# EAGLE design m328plain (EAGLE 7.1.0)
CNAME: ATmega328P PTH + SMD Dev Board; CREVISION: 0.1; DESIGNER: RNDC
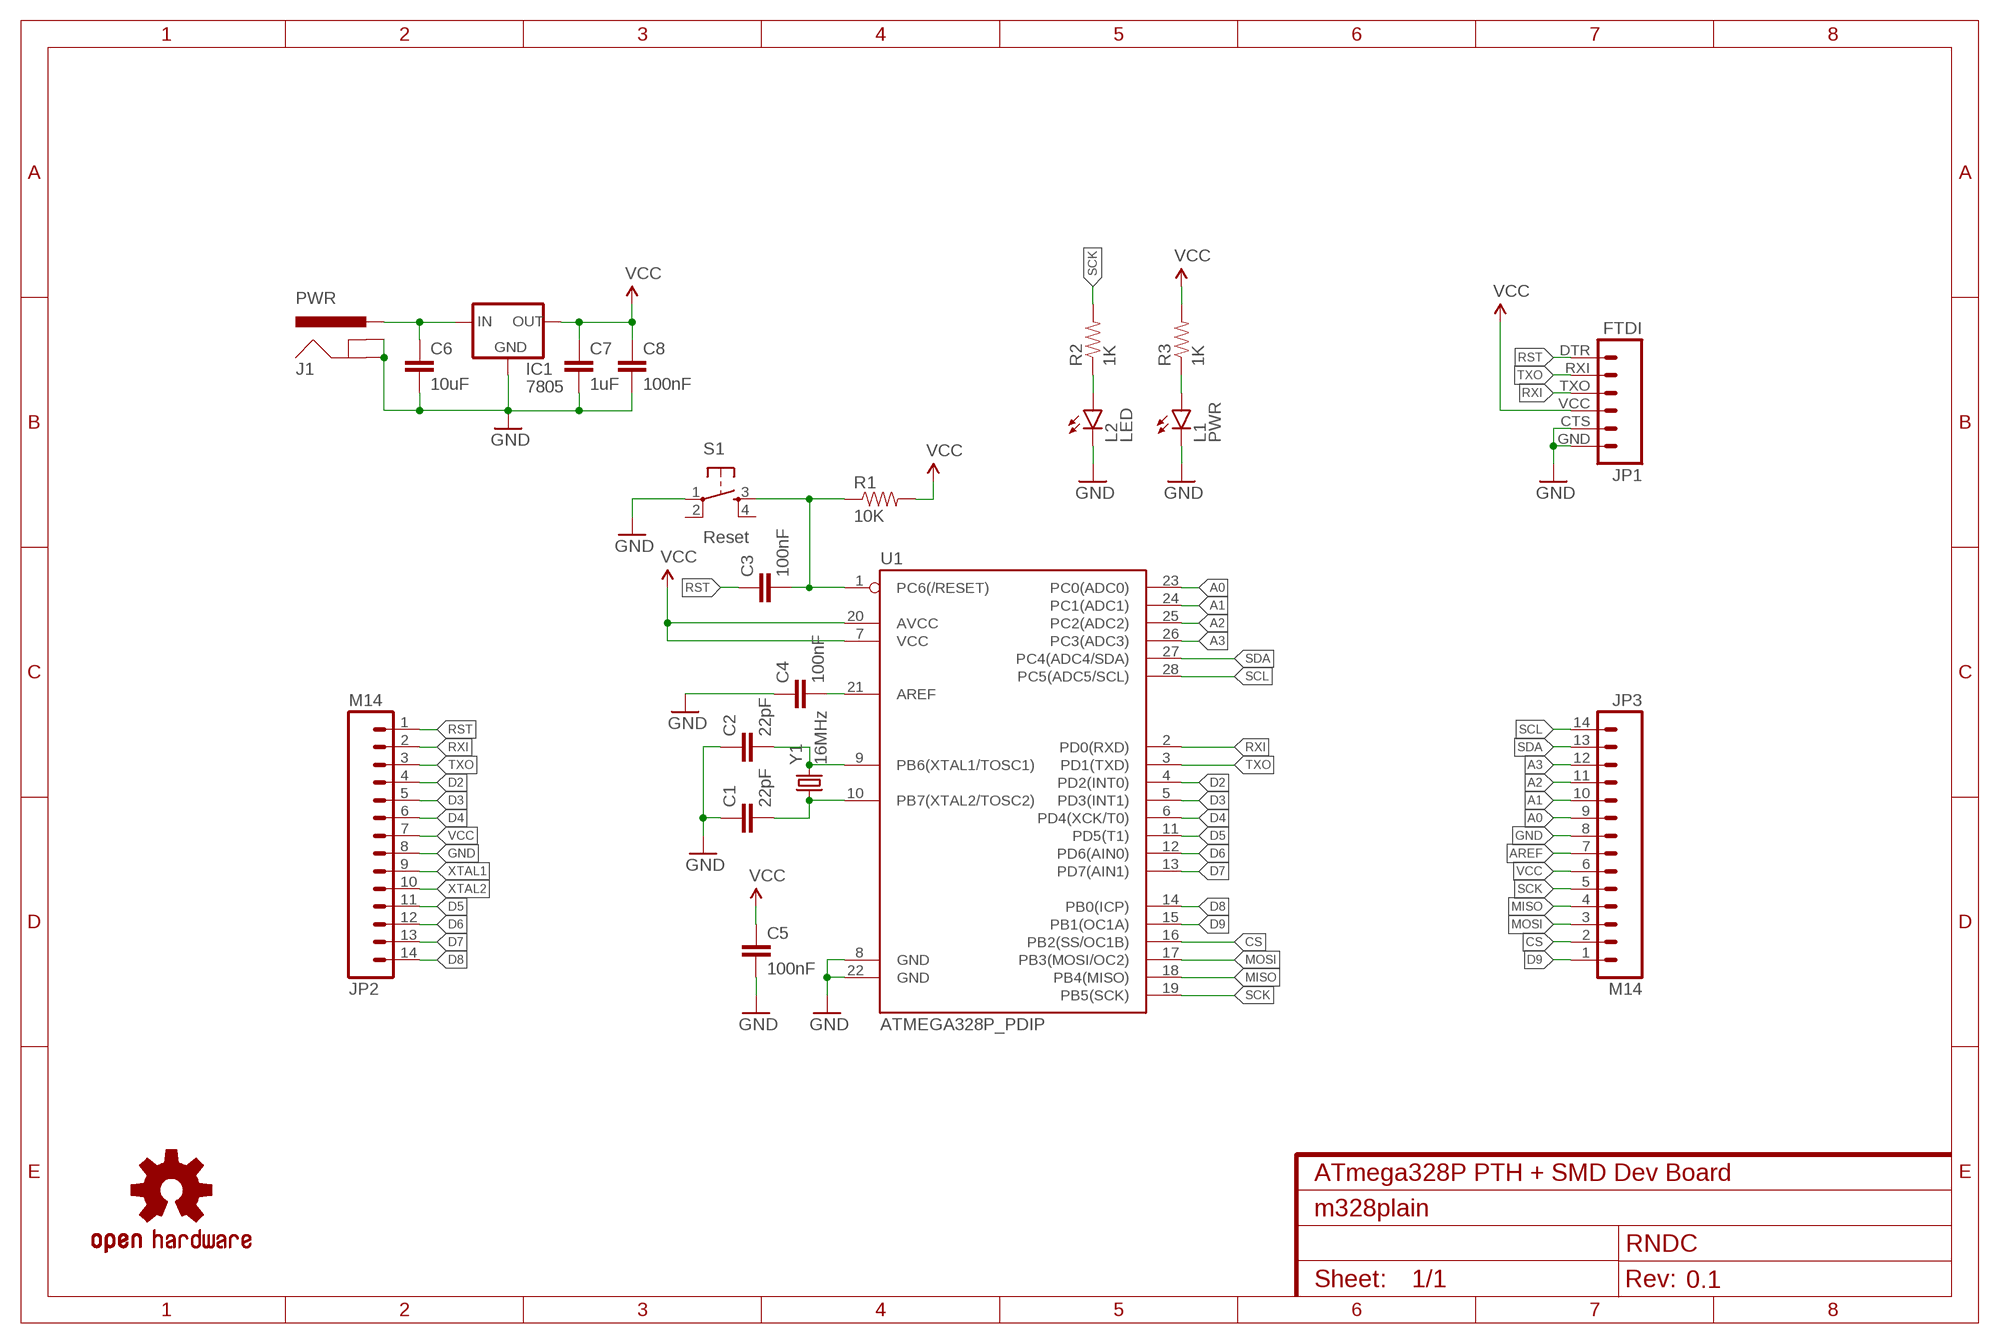
[diagram p0: schematic, sheet 1]

## Parts
C1  22pF  CAP0805  [0805]
C2  22pF  CAP0805  [0805]
C3  100nF  CAP0805  [0805]
C4  100nF  CAP0805  [0805]
C5  100nF  CAP0805  [0805]
C6  10uF  CAP0603-CAP  [0603-CAP]
C7  1uF  CAP0603-CAP  [0603-CAP]
C8  100nF  CAP0805  [0805]
IC1  7805  V_REG_78XXTO-92_UNTESTED  [TO-92]
J1  PWR  POWER_JACKPTH  [POWER_JACK_PTH]
JP1  FTDI  FTDI_BASICPTH  [FTDI_BASIC]
JP2  M14  [1X14]
JP3  M14  [1X14]
L1  PWR  LED-3MM-NO_SILK  [LED3MM-NS]
L2  LED  LED-3MM-NO_SILK  [LED3MM-NS]
LOGO1  OSHW-LOGOL  [OSHW-LOGO-L]
R1  10K  RESISTOR0603  [0603-RES]
R2  1K  RESISTOR0603-RES  [0603-RES]
R3  1K  RESISTOR0603-RES  [0603-RES]
S1  Reset  TAC_SWITCHPTH  [TACTILE-PTH]
U1  ATMEGA328P_PDIP  [DIL28-3]
Y1  16MHz  CRYSTALHC49US  [HC49US]

## Nets
A0: JP3.9 U1.23(PC0(ADC0))
A1: JP3.10 U1.24(PC1(ADC1))
A2: JP3.11 U1.25(PC2(ADC2))
A3: JP3.12 U1.26(PC3(ADC3))
AREF: C4.2 JP3.7 U1.21(AREF)
CS: JP3.2 U1.16(PB2(SS/OC1B))
D2: JP2.4 U1.4(PD2(INT0))
D3: JP2.5 U1.5(PD3(INT1))
D4: JP2.6 U1.6(PD4(XCK/T0))
D5: JP2.11 U1.11(PD5(T1))
D6: JP2.12 U1.12(PD6(AIN0))
D7: JP2.13 U1.13(PD7(AIN1))
D8: JP2.14 U1.14(PB0(ICP))
D9: JP3.1 U1.15(PB1(OC1A))
GND: C1.1 C2.1 C4.1 C5.2 C6.2 C7.2 C8.2 IC1.1(GND) J1.GND J1.GNDBREAK JP1.CTS JP1.GND JP2.8 JP3.8 L1.K(C) L2.K(C) S1.1 U1.8(GND) U1.22(GND)
MISO: JP3.4 U1.18(PB4(MISO))
MOSI: JP3.3 U1.17(PB3(MOSI/OC2))
N$3: C3.2 R1.1 S1.3 U1.1(PC6(/RESET))
N$9: C6.1 IC1.2(IN) J1.PWR
N$10: L1.A R3.1
N$11: L2.A R2.1
RST: C3.1 JP1.DTR JP2.1
RXI: JP1.TXO JP2.2 U1.2(PD0(RXD))
SCK: JP3.5 R2.2 U1.19(PB5(SCK))
SCL: JP3.14 U1.28(PC5(ADC5/SCL))
SDA: JP3.13 U1.27(PC4(ADC4/SDA))
TXO: JP1.RXI JP2.3 U1.3(PD1(TXD))
VCC: C5.1 C7.1 C8.1 IC1.3(OUT) JP1.VCC JP2.7 JP3.6 R1.2 R3.2 U1.7(VCC) U1.20(AVCC)
XTAL1: C2.2 JP2.9 U1.9(PB6(XTAL1/TOSC1)) Y1.2
XTAL2: C1.2 JP2.10 U1.10(PB7(XTAL2/TOSC2)) Y1.1
Unconnected: S1.2 S1.4

## Library data of the parts
C1-C8 = SparkFun-Capacitors:CAP: Capacitor Standard 0603 ceramic capacitor, and 0.1" leaded capacitor.
IC1 = SparkFun-PowerIC:V_REG_78XX: Voltage Regulator Standard 7805 5V regulator. IGO (Input Ground Output). Spark Fun Electronics SKU : COM-00107
J1 = SparkFun-Connectors:POWER_JACK: Power Jack This is the standard 5.5mm barrel jack for power. The PTH is the most common, proven, reliable, footprint. The Slot footprint only works if the mill layer is transmitted to the PCB fab house so be warned. Mating wall wart : TOL-00298 (and others); PROD_ID: PRT-00119
JP1 = SparkFun-Connectors:FTDI_BASIC: FTDI Basic header with labels
JP2 JP3 = SparkFun-Connectors:M14: Header 14 Standard 14-pin 0.1" header. Use with straight break away headers (SKU : PRT-00116), right angle break away headers (PRT-00553), swiss pins (PRT-00743), machine pins (PRT-00117), and female headers (PRT-00115).
L1 L2 = SparkFun-LED:LED: LEDs Standard schematic elements and footprints for 5mm, 3mm, 1206, and 0603 sized LEDs. 5mm - Spark Fun Electronics SKU : COM-00529 (and others)
LOGO1 = SparkFun-Aesthetics:OSHW-LOGO: Open Source Hardware Logo This logo indicates the piece of hardware it is found on incorporates a OSHW license and/or adheres to the definition of open source hardware found here: http://freedomdefined.org/OSHW
R1 = SparkFun-Resistors:RESISTOR: Resistor Basic schematic elements and footprints for 0603, 1206, and PTH resistors.
R2 R3 = SparkFun-Passives:RESISTOR: Resistor Basic schematic elements and footprints for 0603, 1206, and PTH resistors.
S1 = SparkFun-Electromechanical:TAC_SWITCH: Momentary Switch Button commonly used for reset or general input. Spark Fun Electronics SKU : COM-00097 SMT- SWCH-08247
U1 = SparkFun-DigitalIC:ATMEGA328P_PDIP: uC used in the Arduino 32kb flash, 1k EEPROM, 2k SRAM This is the through-hole version of this chip.
Y1 = SparkFun-FreqCtrl:CRYSTAL: Various standard crystals. Proven footprints. Spark Fun Electronics SKU : COM-00534

## Board
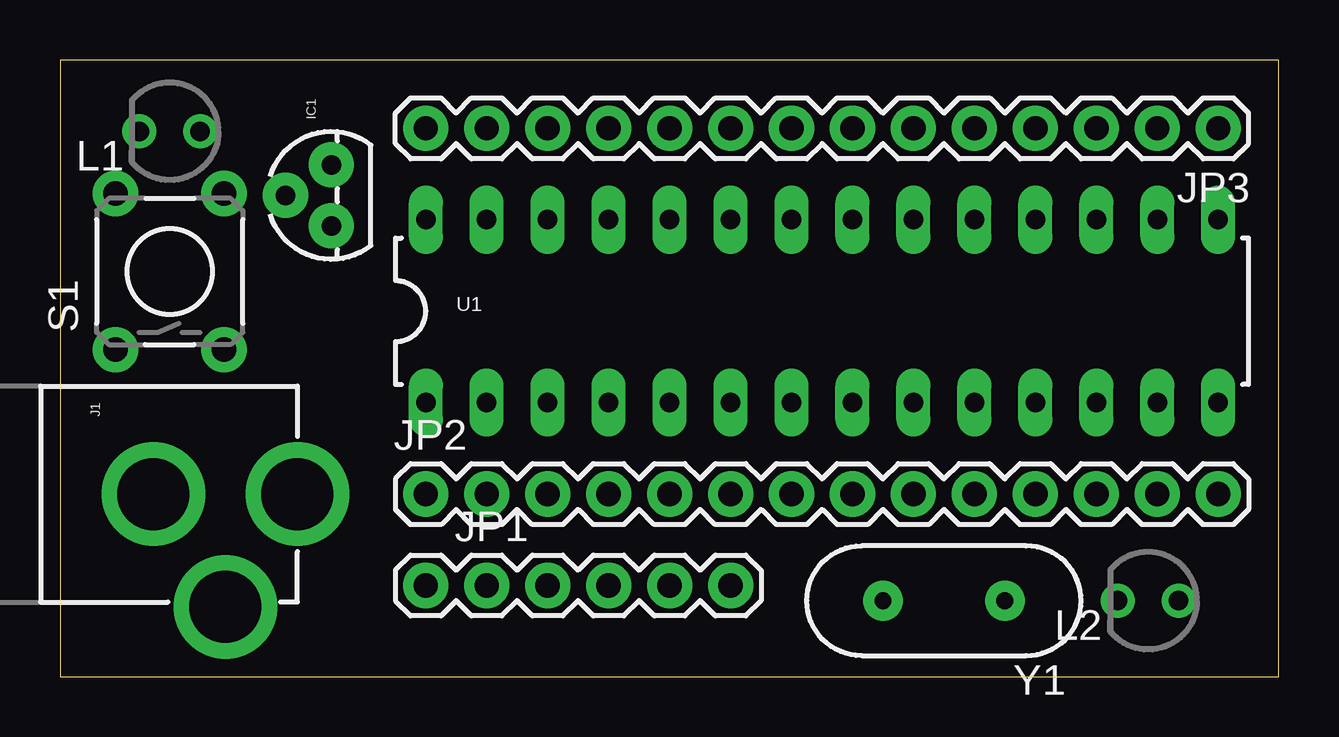
[diagram p1: board, top side]
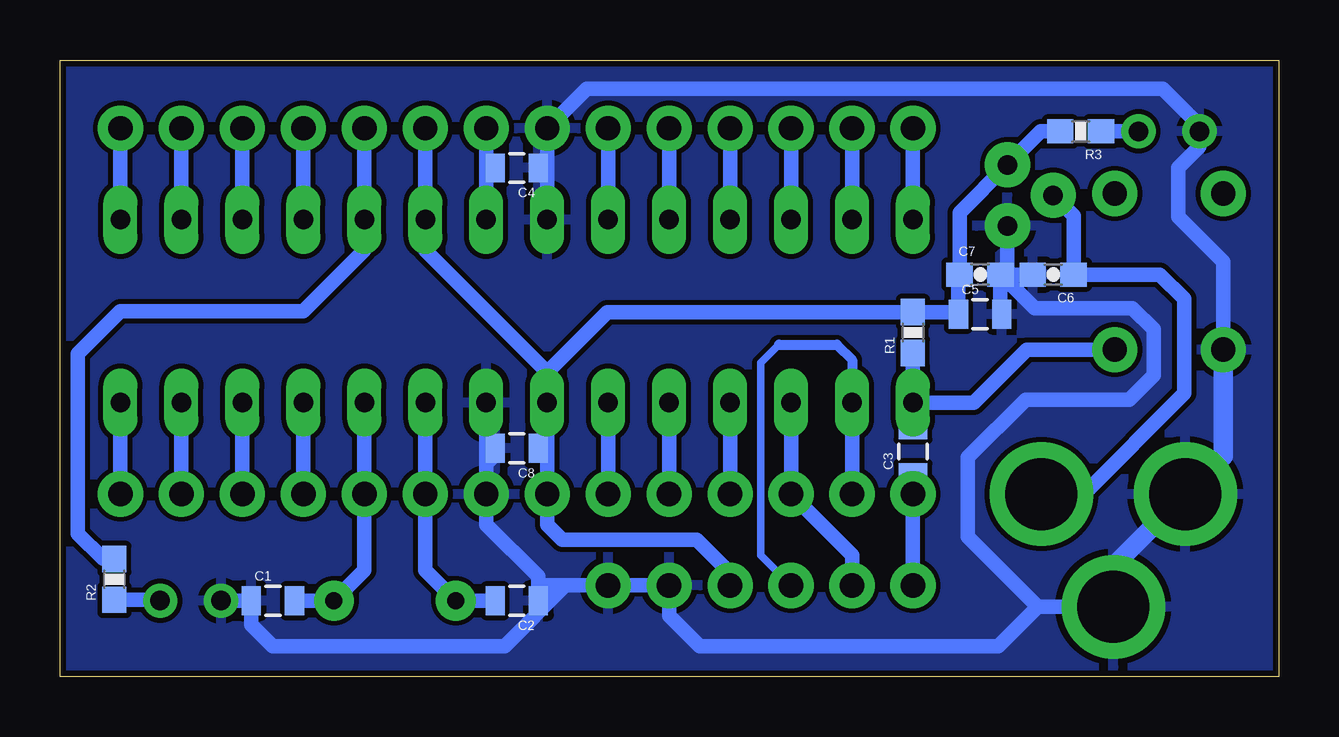
[diagram p2: board, bottom side, seen from below]

Size 50.78 x 25.7 mm. Coordinates in mm from the lower left corner, seen from the top.
Outline: 0,0 50.78,0 50.78,25.7 0,25.7 0,0
Copper layers (1*16): Top 0.035mm / dielectric 1.5mm / Bottom 0.035mm
Design rules "sfe-drc *": minimum track width 8mil, minimum drill 20mil, track to track 8mil, track to pad 8mil, pad to pad 8mil, via to via 8mil, smd to smd 8mil, copper to edge 10mil, drill to drill 8mil, minimum pad ring 12mil, minimum via ring 10mil, stop-mask expansion 4mil, vias tented up to drill 25mil, thermal gap 10mil

### Footprints (pad centres in the part's own frame; a part is rotated, then mirrored left to right if it is on the bottom)
0805 = smd 0.8 x 1.2: 1 -0.9,0; 2 0.9,0
0603-CAP = smd 1.1 x 1: 1 -0.85,0; 2 0.85,0
TO-92 = drill 0.813 pad 1.88: 1 -1.27,0; 2 0,1.905; 3 1.27,0
POWER_JACK_PTH = drill 2.997 pad 4.318: GND 0,7.7; GNDBREAK 4.7,10.7; PWR 0,13.7
FTDI_BASIC = drill 1.016 pad 1.88: CTS 10.16,0; DTR 0,0; GND 12.7,0; RXI 2.54,0; TXO 5.08,0; VCC 7.62,0
1X14 = drill 1.016 pad 1.88: 1 0,0; 2 2.54,0; 3 5.08,0; 4 7.62,0; 5 10.16,0; 6 12.7,0; 7 15.24,0; 8 17.78,0; 9 20.32,0; 10 22.86,0; 11 25.4,0; 12 27.94,0; 13 30.48,0; 14 33.02,0
LED3MM-NS = drill 0.813: A -1.27,0; K 1.27,0
0603-RES = smd 1.1 x 1: 1 -0.85,0; 2 0.85,0
TACTILE-PTH = drill 1.016 pad 1.88: 1 -3.251,2.261; 2 3.251,2.261; 3 -3.251,-2.261; 4 3.251,-2.261
DIL28-3 = drill 0.813 long: 1 -16.51,-3.81; 2 -13.97,-3.81; 3 -11.43,-3.81; 4 -8.89,-3.81; 5 -6.35,-3.81; 6 -3.81,-3.81; 7 -1.27,-3.81; 8 1.27,-3.81; 9 3.81,-3.81; 10 6.35,-3.81; 11 8.89,-3.81; 12 11.43,-3.81; 13 13.97,-3.81; 14 16.51,-3.81; 15 16.51,3.81; 16 13.97,3.81; 17 11.43,3.81; 18 8.89,3.81; 19 6.35,3.81; 20 3.81,3.81; 21 1.27,3.81; 22 -1.27,3.81; 23 -3.81,3.81; 24 -6.35,3.81; 25 -8.89,3.81; 26 -11.43,3.81; 27 -13.97,3.81; 28 -16.51,3.81
HC49US = drill 0.7 pad 1.651: 1 -2.54,0; 2 2.54,0

### Placement (x,y rotation side)
C1  41.91,3.17 0 bottom
C2  31.75,3.17 180 bottom
C3  15.24,9.4 90 bottom
C4  31.75,21.21 180 bottom
C5  12.45,15.11 0 bottom
C6  9.4,16.76 180 bottom
C7  12.45,16.76 0 bottom
C8  31.75,9.53 180 bottom
IC1  11.3,20.07 90 top
J1  -3.81,7.62 270 top
JP1  15.24,3.81 0 top
JP2  15.24,7.62 0 top
JP3  48.26,22.86 180 top
L1  4.57,22.73 180 top
L2  45.34,3.17 180 top
R1  15.24,14.35 90 bottom
R2  48.51,4.06 90 bottom
R3  8.26,22.73 180 bottom
S1  4.57,16.89 90 top
U1  31.75,15.24 0 top
Y1  36.83,3.17 180 top

### Tracks (layer width: path | path; a pad name or v marks a point on that pad's centre or on a via)
A0
  Bottom 0.61: JP3.9 U1.23
A1
  Bottom 0.61: JP3.10 U1.24
A2
  Bottom 0.61: JP3.11 U1.25
A3
  Bottom 0.61: JP3.12 U1.26
AREF
  Bottom 0.61: JP3.7 33.02,21.59 | 33.02,21.59 U1.21 | C4.2 33.02,21.59
CS
  Bottom 0.61: JP3.2 U1.16
D2
  Bottom 0.61: JP2.4 U1.4
D3
  Bottom 0.61: JP2.5 U1.5
D4
  Bottom 0.61: JP2.6 U1.6
D5
  Bottom 0.61: U1.11 JP2.11
D6
  Bottom 0.61: U1.12 JP2.12
D7
  Bottom 0.61: U1.13 JP2.13
D8
  Bottom 0.61: U1.14 JP2.14
D9
  Bottom 0.61: JP3.1 U1.15
GND
  Bottom 0.61: C5.2 11.6,15.16 C7.2 C6.2 11.18,16.76 11.24,16.7 | IC1.1 11.3,16.76 11.24,16.7 | S1.1 2.31,17.3 4.19,19.18 4.19,21.21 3.3,22.1 L1.K 3.3,22.99 4.83,24.51 28.83,24.51 JP3.8 30.48,21.59 | 11.24,16.7 11.24,16.45 10.16,15.37 6.1,15.37 5.21,14.48 5.21,12.57 6.22,11.56 10.54,11.56 12.95,9.14 12.95,5.84 10.03,2.92 | 10.03,2.92 J1.GNDBREAK | U1.8 33.02,8.89 | 33.02,8.89 JP2.8 33.02,6.35 30.86,4.19 30.86,3.81 | C8.2 32.65,9.26 33.02,8.89 | 30.48,21.59 U1.22 | C4.1 30.48,21.59 | 30.86,3.81 30.86,3.19 C2.1 | 29.72,3.81 JP1.GND JP1.CTS 25.4,2.54 24.13,1.27 11.68,1.27 10.03,2.92 | 29.72,3.81 30.86,3.81 | 29.72,3.81 32.26,1.27 41.91,1.27 42.81,2.17 C1.1 L2.K
  Bottom 0.813: S1.1 2.31,9.2 J1.GND 6.89,4.62 J1.GNDBREAK
  pour Bottom: 0,0 50.8,0 50.8,25.4 0,25.4
MISO
  Bottom 0.61: JP3.4 U1.18
MOSI
  Bottom 0.61: JP3.3 U1.17
N$3
  Bottom 0.61: R1.1 U1.1 | C3.2 U1.1 | S1.3 10.49,13.64 12.7,11.43 U1.1
N$9
  Bottom 0.61: IC1.2 8.55,19.22 C6.1 4.95,16.76 3.94,15.75 3.94,11.81 8.13,7.62 J1.PWR
N$10
  Bottom 0.61: L1.A R3.1
N$11
  Bottom 0.61: R2.1 46.65,3.21 L2.A
RST
  Bottom 0.61: C3.1 JP2.1 JP1.DTR
RXI
  Bottom 0.305: 20.83,13.84 21.59,13.08 21.59,5.08 JP1.TXO
  Bottom 0.406: 20.83,13.84 18.41,13.84 17.78,13.21 U1.2
  Bottom 0.61: U1.2 JP2.2
SCK
  Bottom 0.61: JP3.5 U1.19 38.1,17.78 40.64,15.24 48.26,15.24 50.04,13.46 50.04,5.97 48.98,4.91 R2.2
SCL
  Bottom 0.61: JP3.14 U1.28
SDA
  Bottom 0.61: JP3.13 U1.27
TXO
  Bottom 0.61: U1.3 JP2.3 17.78,5.08 JP1.RXI
VCC
  Bottom 0.61: R3.2 9.91,22.73 IC1.3 13.3,19.34 C7.1 13.35,16.71 C5.1 13.43,15.2 R1.2 27.98,15.2 30.48,12.7 | 30.48,10.16 U1.7 30.48,12.7 | 30.48,10.16 JP2.7 30.48,6.35 29.84,5.71 24.26,5.71 22.86,4.32 JP1.VCC | C8.1 30.85,9.79 30.48,10.16 | JP3.6 U1.20 35.56,17.78 30.48,12.7
XTAL1
  Bottom 0.61: U1.9 JP2.9 35.56,4.45 Y1.2 C2.2
XTAL2
  Bottom 0.61: U1.10 JP2.10 38.1,4.45 Y1.1 C1.2